# EasyEDA schematic SCH_d_00_e_01.json
TITLE: EX01; REV: 1.0; Date: 2025-01-09; Sheet: 1/1; Drawn By: artem.v.ulyanov; Company: provemet
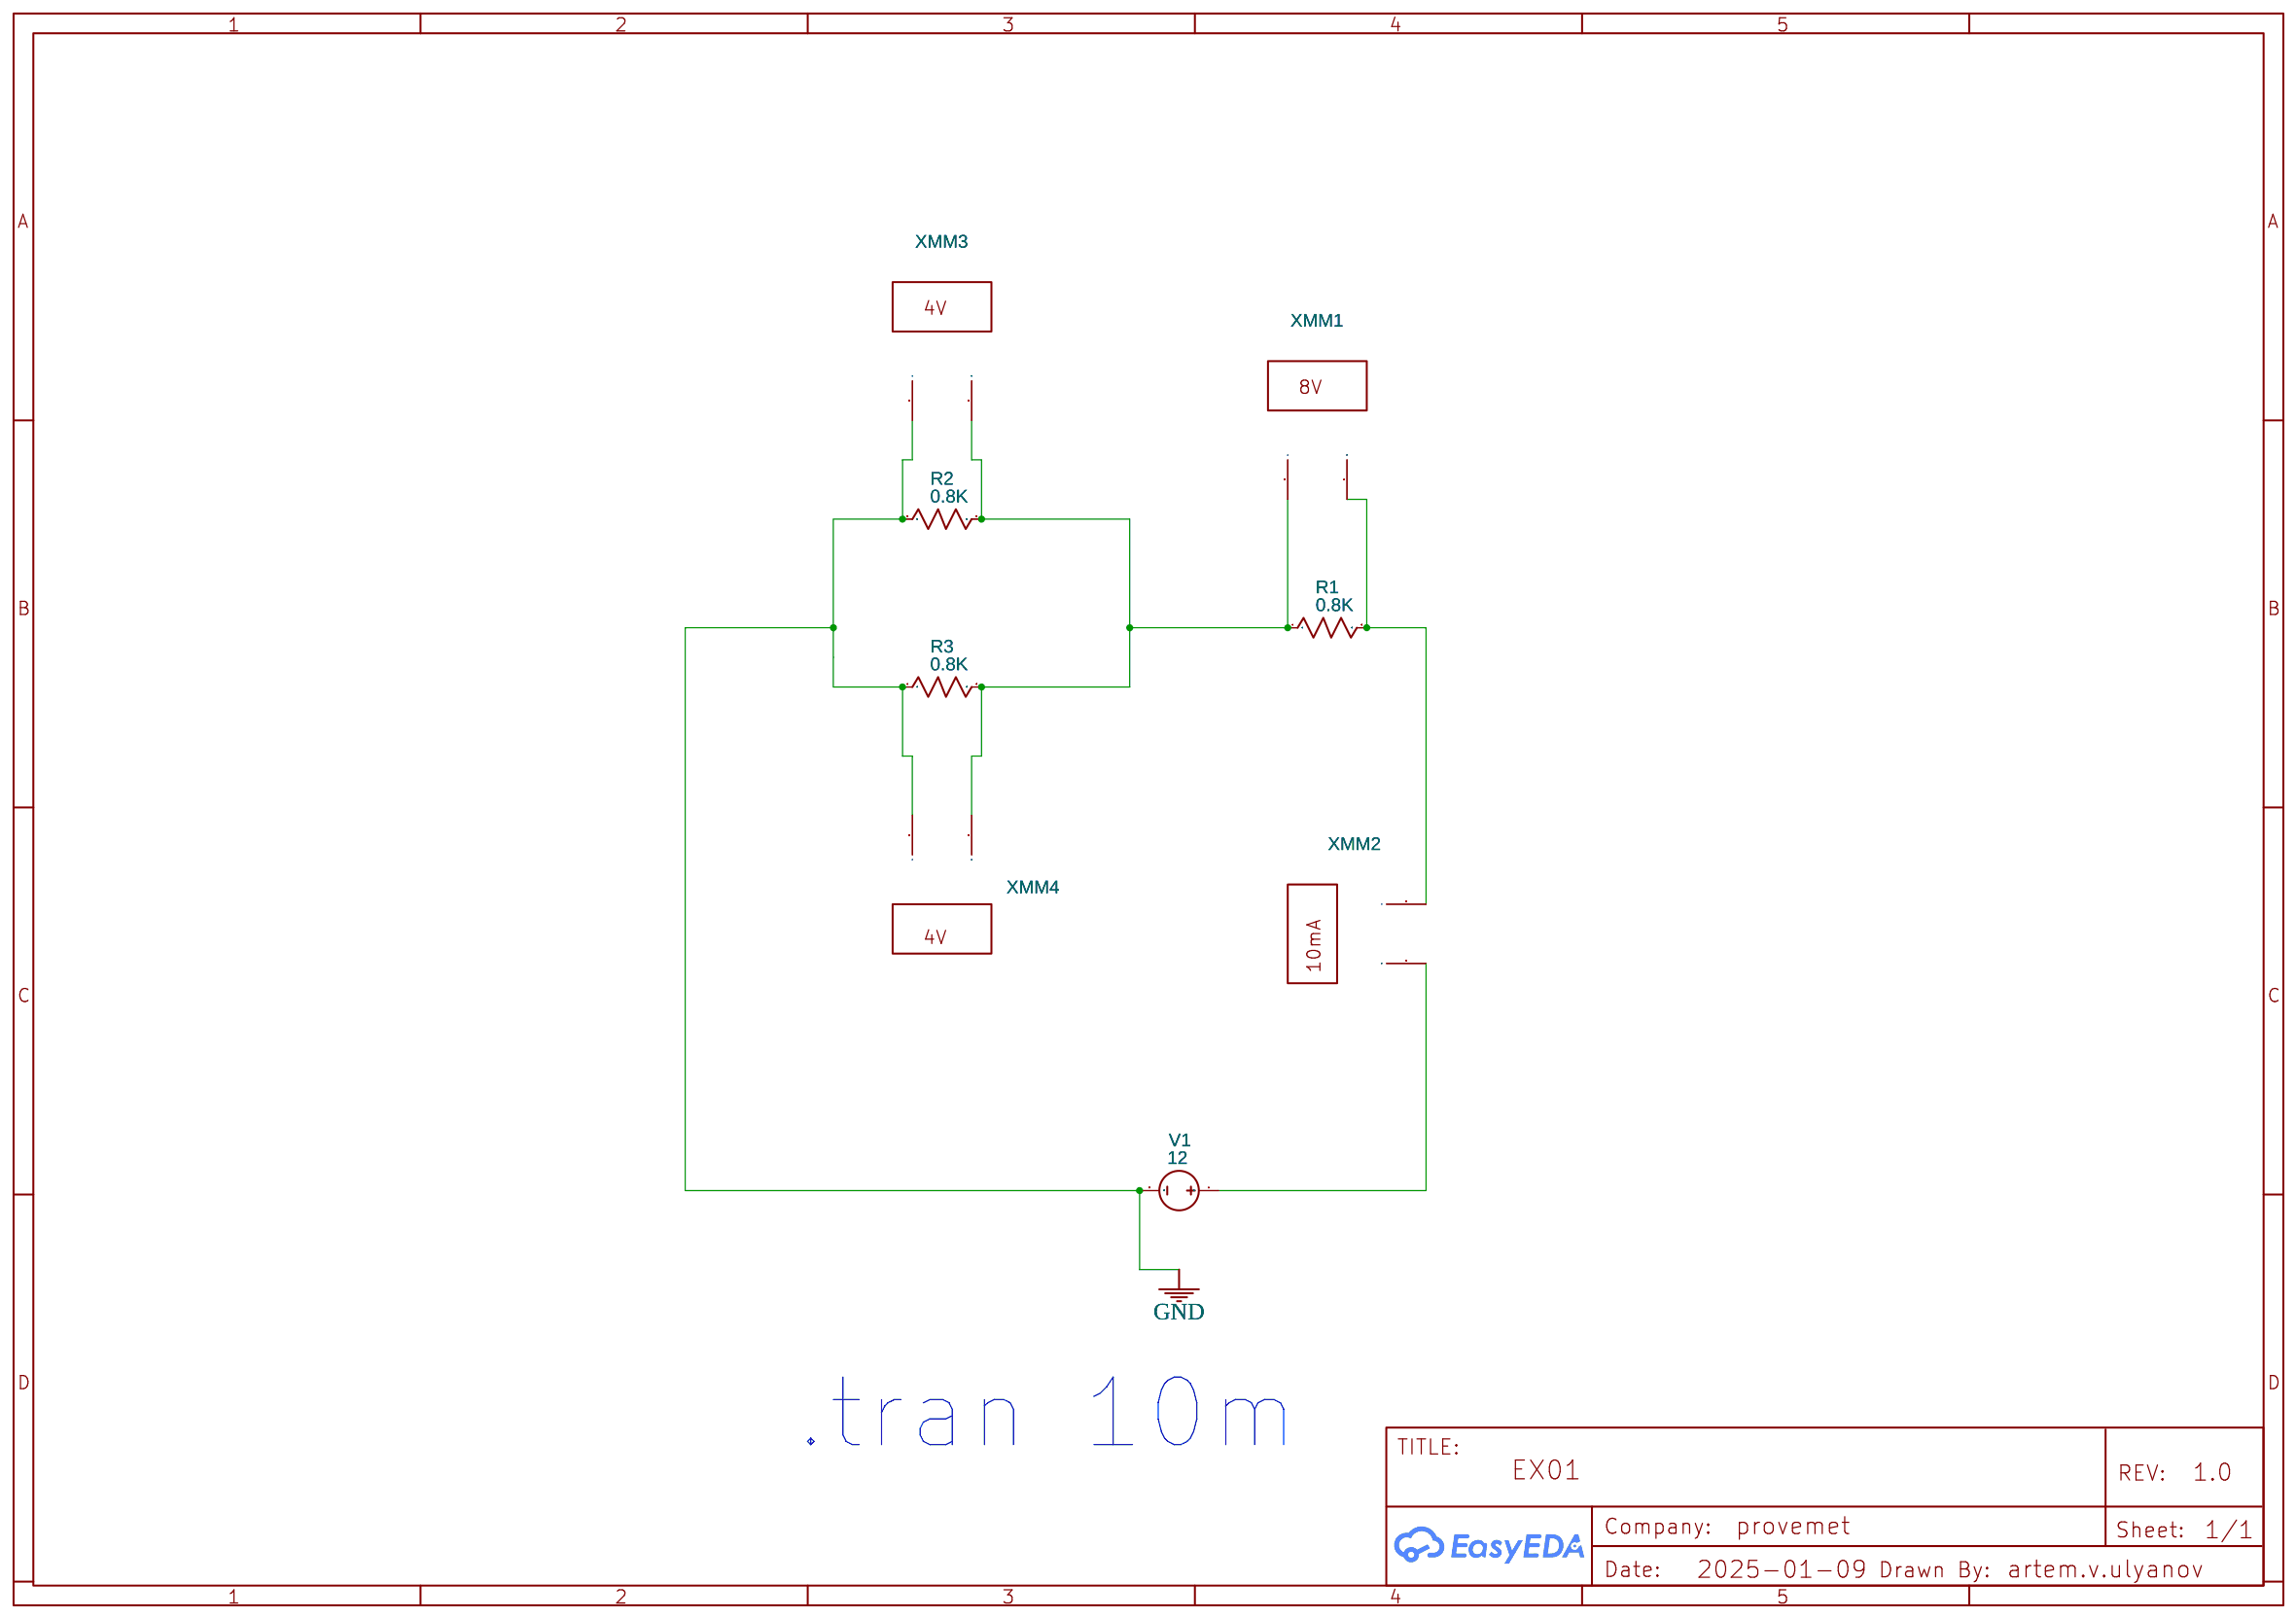
[diagram p0: schematic sheet]

## Parts
R1  0.8K  [AXIAL-0.3]
R2  0.8K  [AXIAL-0.3]
R3  0.8K  [AXIAL-0.3]
V1  12  [HDR1X2]
XMM1  Multimeter
XMM2  Multimeter
XMM3  Multimeter
XMM4  Multimeter

## Library data of the parts
R1-R3 = Resistor_US: Resistance: 1k; Contributor: EasyEDA; Supplier: YUJING
V1 = VDC: Contributor: EasyEDA; sim: true
XMM1 XMM3 XMM4 = MULTIMETER: Supplier: LCSC; Multimeter Type: Voltmeter; Power Type: AC; Voltmeter resistance: 10μ; Ammeter resistance: 1G; NameDisplay: 0; Contributor: EasyEDA; sim: true
XMM2 = MULTIMETER: Supplier: LCSC; Multimeter Type: Amper; Power Type: AC; Voltmeter resistance: 10μ; Ammeter resistance: 1G; NameDisplay: 0; Contributor: EasyEDA; sim: true

## Nets
GND: R2.1 R3.1 V1.2 XMM3.2(I) XMM4.2(I)
Net-(R1-1): R1.1 R2.2 R3.2 XMM1.2(I) XMM3.1(+) XMM4.1(+)
Net-(R1-2): R1.2 XMM1.1(+) XMM2.2(I)
Net-(V1-1): V1.1 XMM2.1(+)

## Notes on the sheet
- .tran 10m
